# EAGLE design bipop_power_supply (EAGLE 8.3.2)
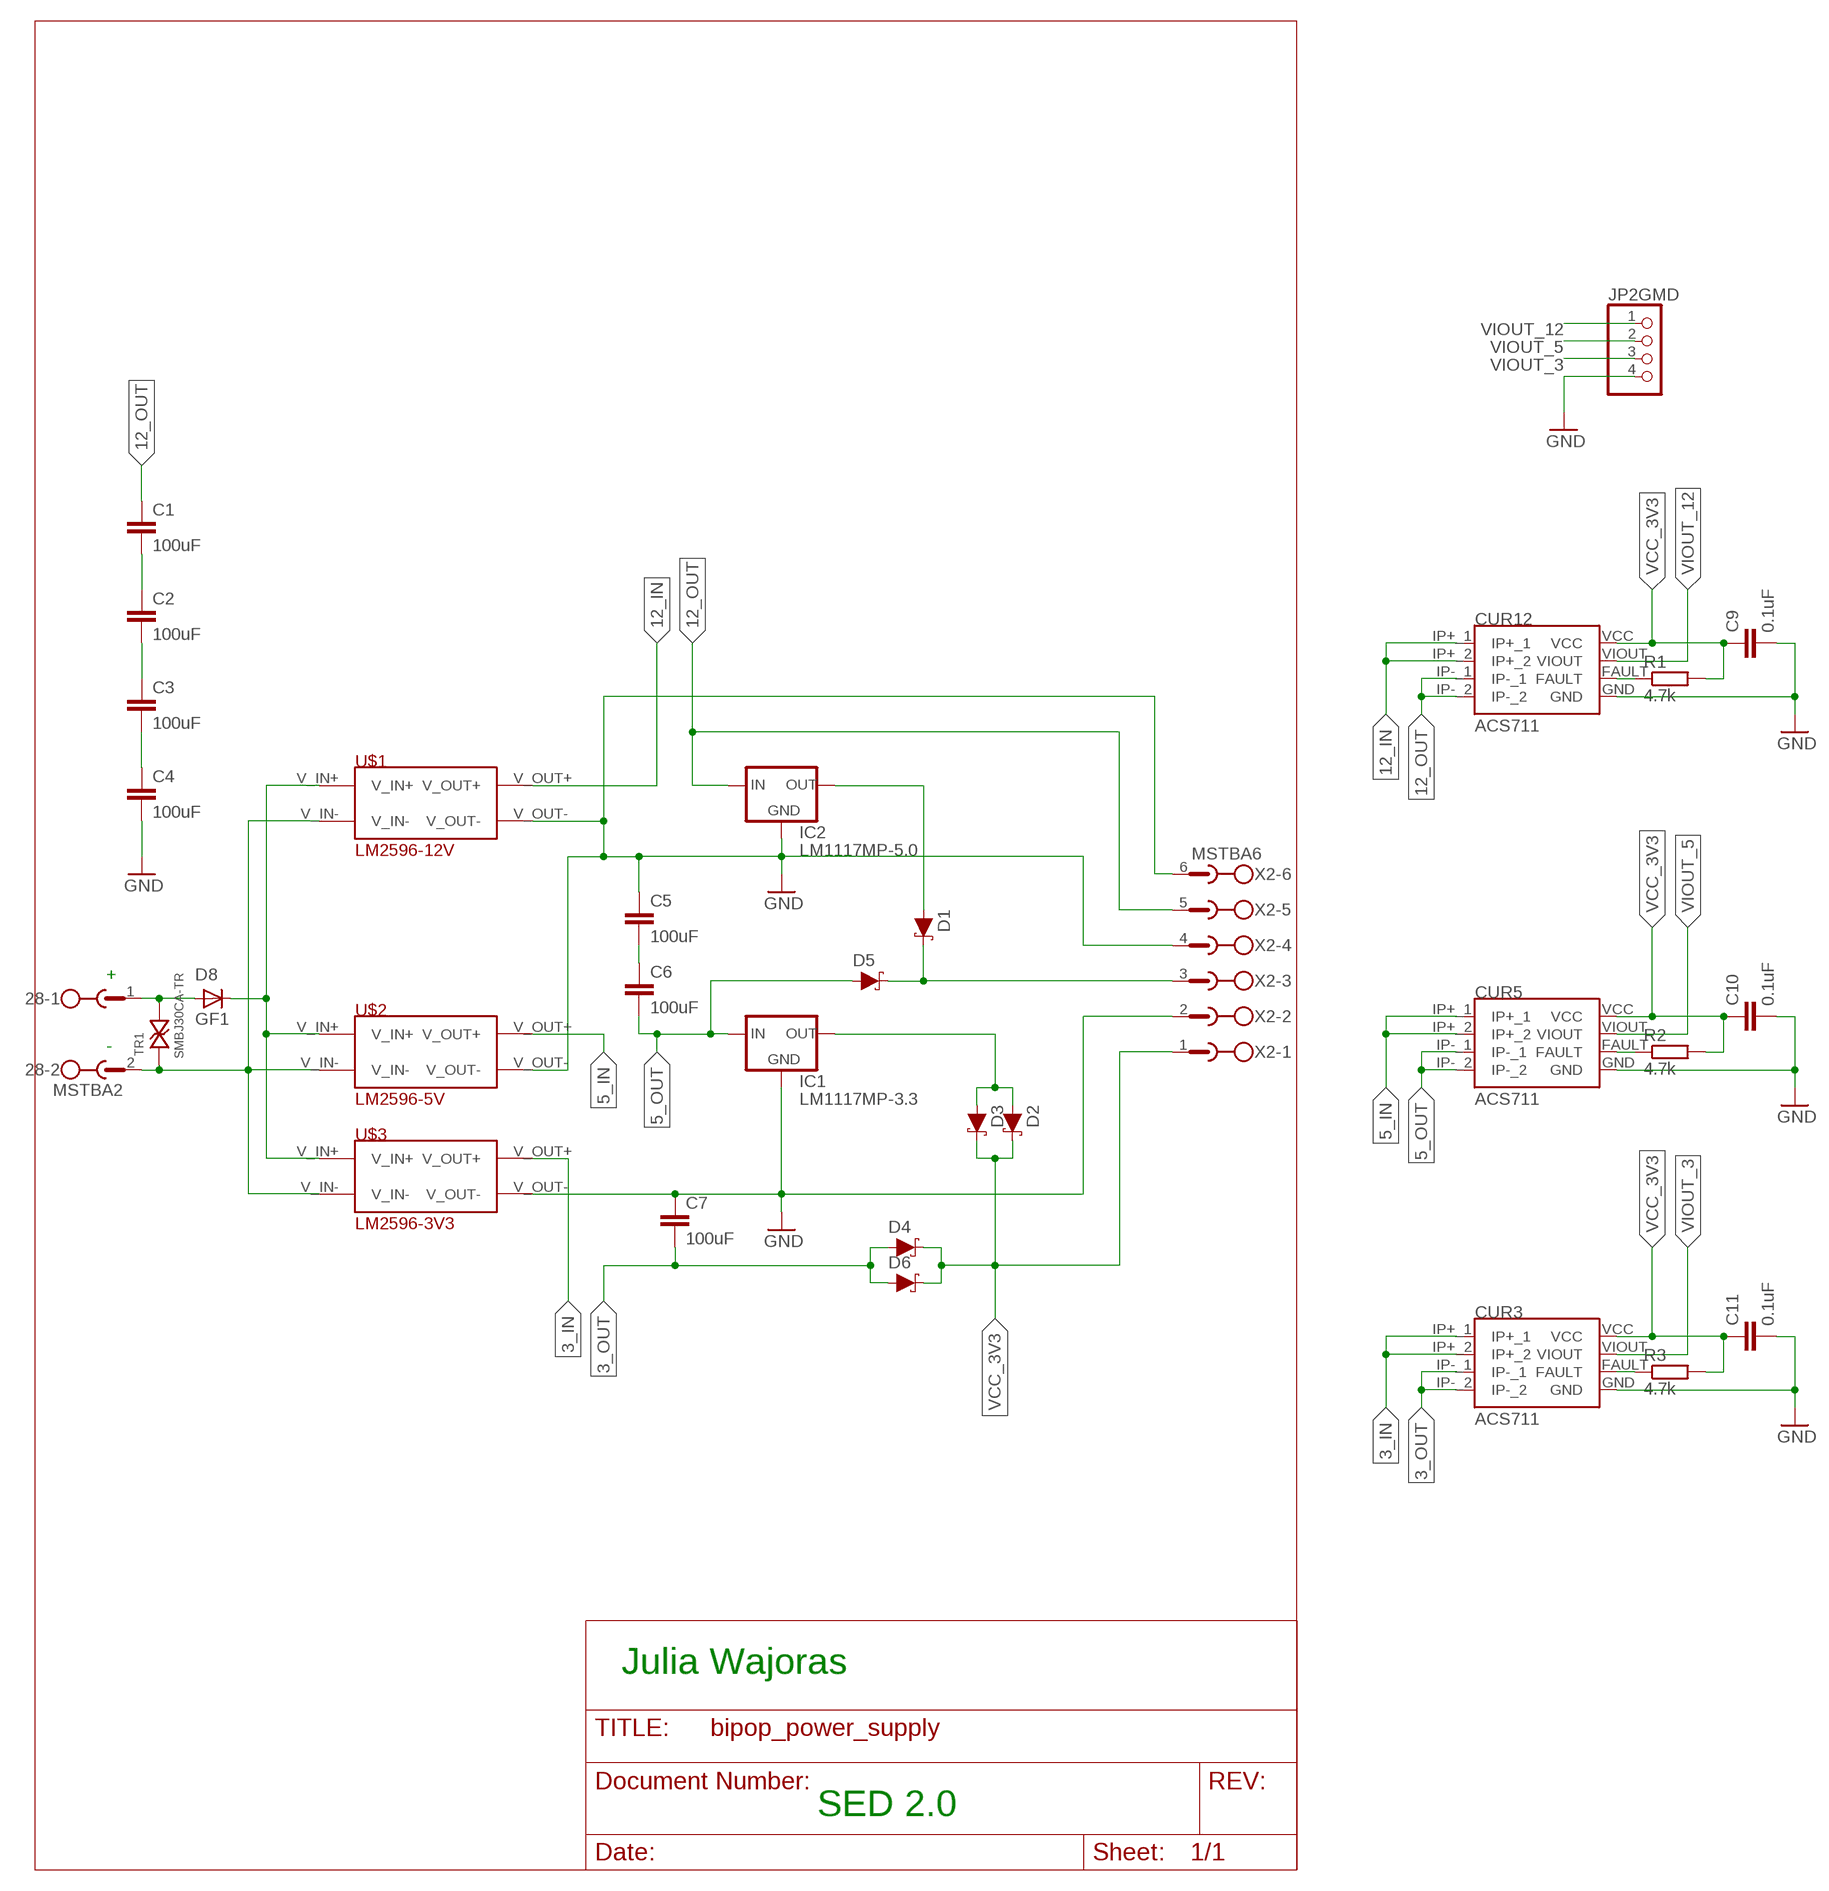
[diagram p0: schematic, sheet 1]

## Parts
28  MSTBA2  [MSTBA2]
C1  100uF  C-EUC0805  [C0805]
C2  100uF  C-EUC0805  [C0805]
C3  100uF  C-EUC0805  [C0805]
C4  100uF  C-EUC0805  [C0805]
C5  100uF  C-EUC0805  [C0805]
C6  100uF  C-EUC0805  [C0805]
C7  100uF  C-EUC0805  [C0805]
C9  0.1uF  C-EUC0805  [C0805]
C10  0.1uF  C-EUC0805  [C0805]
C11  0.1uF  C-EUC0805  [C0805]
CUR3  ACS711  [ACS711]
CUR5  ACS711  [ACS711]
CUR12  ACS711  [ACS711]
D1  DIODE-SCHOTTKY-BAT20J  [SOD-323]
D2  DIODE-SCHOTTKY-BAT20J  [SOD-323]
D3  DIODE-SCHOTTKY-BAT20J  [SOD-323]
D4  DIODE-SCHOTTKY-BAT20J  [SOD-323]
D5  DIODE-SCHOTTKY-BAT20J  [SOD-323]
D6  DIODE-SCHOTTKY-BAT20J  [SOD-323]
D8  GF1  [SMA-DO214AC]
IC1  LM1117MP-3.3  [SOT223]
IC2  LM1117MP-5.0  [SOT223]
JP2GMD  PINHD-1X4  [1X04]
R1  4.7k  R-EU_R0805  [R0805]
R2  4.7k  R-EU_R0805  [R0805]
R3  4.7k  R-EU_R0805  [R0805]
TR1  SMBJ30CA-TR  SMAJ30CA-TR__DO214AC  [DO214AC_BIDIR]
U$1  LM2596-12V  [DC-DC_CONVERTER]
U$2  LM2596-5V  [DC-DC_CONVERTER]
U$3  LM2596-3V3  [DC-DC_CONVERTER]
X2  MSTBA6  [MSTBA6]

## Nets
3_IN: CUR3.IP+_1 CUR3.IP+_2 U$3.V_OUT+
3_OUT: C7.2 CUR3.IP-_1 CUR3.IP-_2 D4.A D6.A
5_IN: CUR5.IP+_1 CUR5.IP+_2 U$2.V_OUT+
5_OUT: C6.2 CUR5.IP-_1 CUR5.IP-_2 D5.A IC1.3(IN)
12_IN: CUR12.IP+_1 CUR12.IP+_2 U$1.V_OUT+
12_OUT: C1.1 CUR12.IP-_1 CUR12.IP-_2 IC2.3(IN) X2.5
GND: C4.2 C5.1 C7.1 C9.2 C10.2 C11.2 CUR3.GND CUR5.GND CUR12.GND IC1.1(GND) IC2.1(GND) JP2GMD.4 U$1.V_OUT- U$2.V_OUT- U$3.V_OUT- X2.2 X2.4 X2.6
MM: D8.K(C) U$1.V_IN+ U$2.V_IN+ U$3.V_IN+
N$1: CUR3.FAULT R3.1
N$2: C2.2 C3.1
N$3: D1.A IC2.2(OUT)
N$4: CUR5.FAULT R2.1
N$5: D2.A D3.A IC1.2(OUT)
N$6: C3.2 C4.1
N$7: CUR12.FAULT R1.1
N$8: C5.2 C6.1
N$9: C1.2 C2.1
N$10: 28.2 TR1.P$1 U$1.V_IN- U$2.V_IN- U$3.V_IN-
N$12: 28.1 D8.A TR1.P$2
N$16: D1.C D5.C X2.3
VCC_3V3: C9.1 C10.1 C11.1 CUR3.VCC CUR5.VCC CUR12.VCC D2.C D3.C D4.C D6.C R1.2 R2.2 R3.2 X2.1
VIOUT_3: CUR3.VIOUT JP2GMD.3
VIOUT_5: CUR5.VIOUT JP2GMD.2
VIOUT_12: CUR12.VIOUT JP2GMD.1

## Notes on the sheet
- +
- -
- Julia Wajoras
- SED 2.0

## Library data of the parts
28 = con-phoenix-508:MSTBA2: PHOENIX
C1-C7 C9-C11 = rcl:C-EU: CAPACITOR, European symbol
CUR3 CUR5 CUR12 = lustro_pcb:ACS711
D1-D6 = sparkfun-discrete-semi:DIODE-SCHOTTKY: Schottky diode A Schottky diode is a semiconductor diode which has a low forward voltage drop and a very fast switching action.; PROD_ID: DIO-11623; VALUE: 1A/23V/620mV
D8 = _mod_diode:GF1: DIODE
IC1 = lm1117_10:LM1117?-*: 800mA Low-Dropout Linear Regulator Source: http://www.ti.com/lit/ds/symlink/lm1117-n.pdf; MF: Texas Instruments; MPN: LM1117MP-3.3; OC_FARNELL: 9778195; OC_NEWARK: 28X3416
IC2 = lm1117_10:LM1117?-*: 800mA Low-Dropout Linear Regulator Source: http://www.ti.com/lit/ds/symlink/lm1117-n.pdf; MF: Texas Instruments; MPN: LM1117MP-5.0; OC_FARNELL: 9778209; OC_NEWARK: 28X3417
JP2GMD = pinhead:PINHD-1X4: PIN HEADER
R1-R3 = rcl:R-EU_: RESISTOR, European symbol
TR1 = transil:SMAJ30CA-TR__DO214AC: Transil SMAJ 30 Volt BIDIR. DO214AC Package.
U$1-U$3 = lustro_pcb:LM2596-
X2 = con-phoenix-508:MSTBA6: PHOENIX; MF: FARNELL; MPN: 1757284; OC_FARNELL: 3705213; OC_NEWARK: 71C4165

## Net classes
0 default: width 0.508 mm

## Board
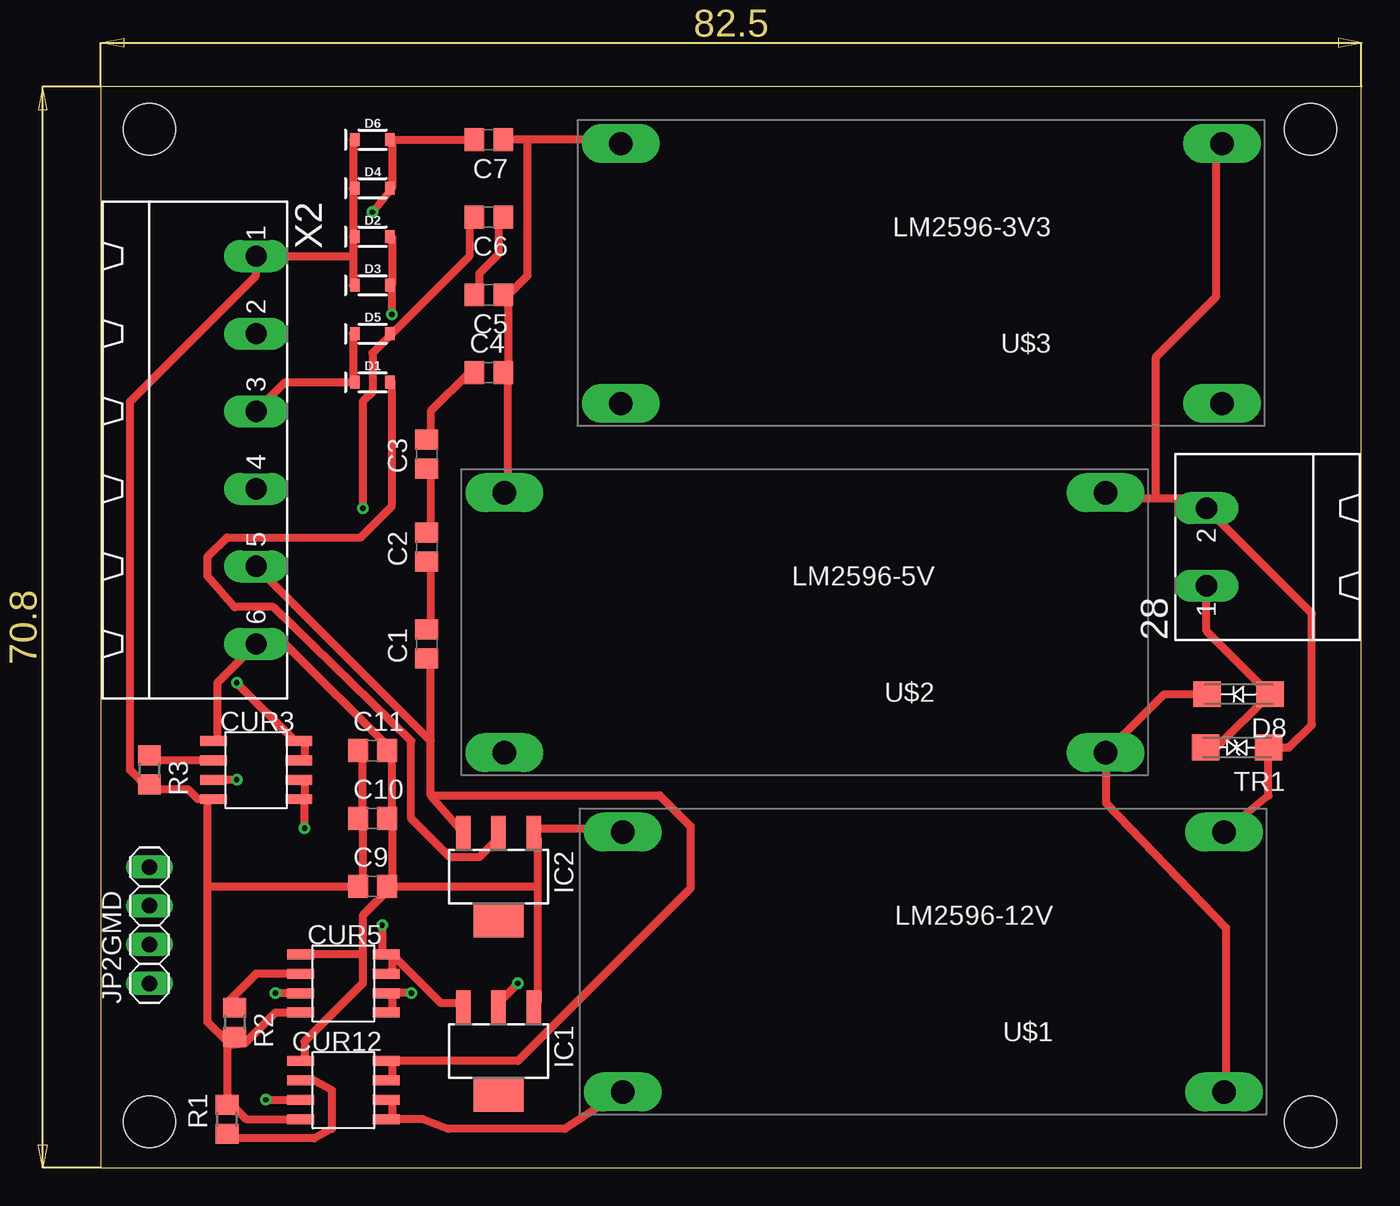
[diagram p1: board, top side]
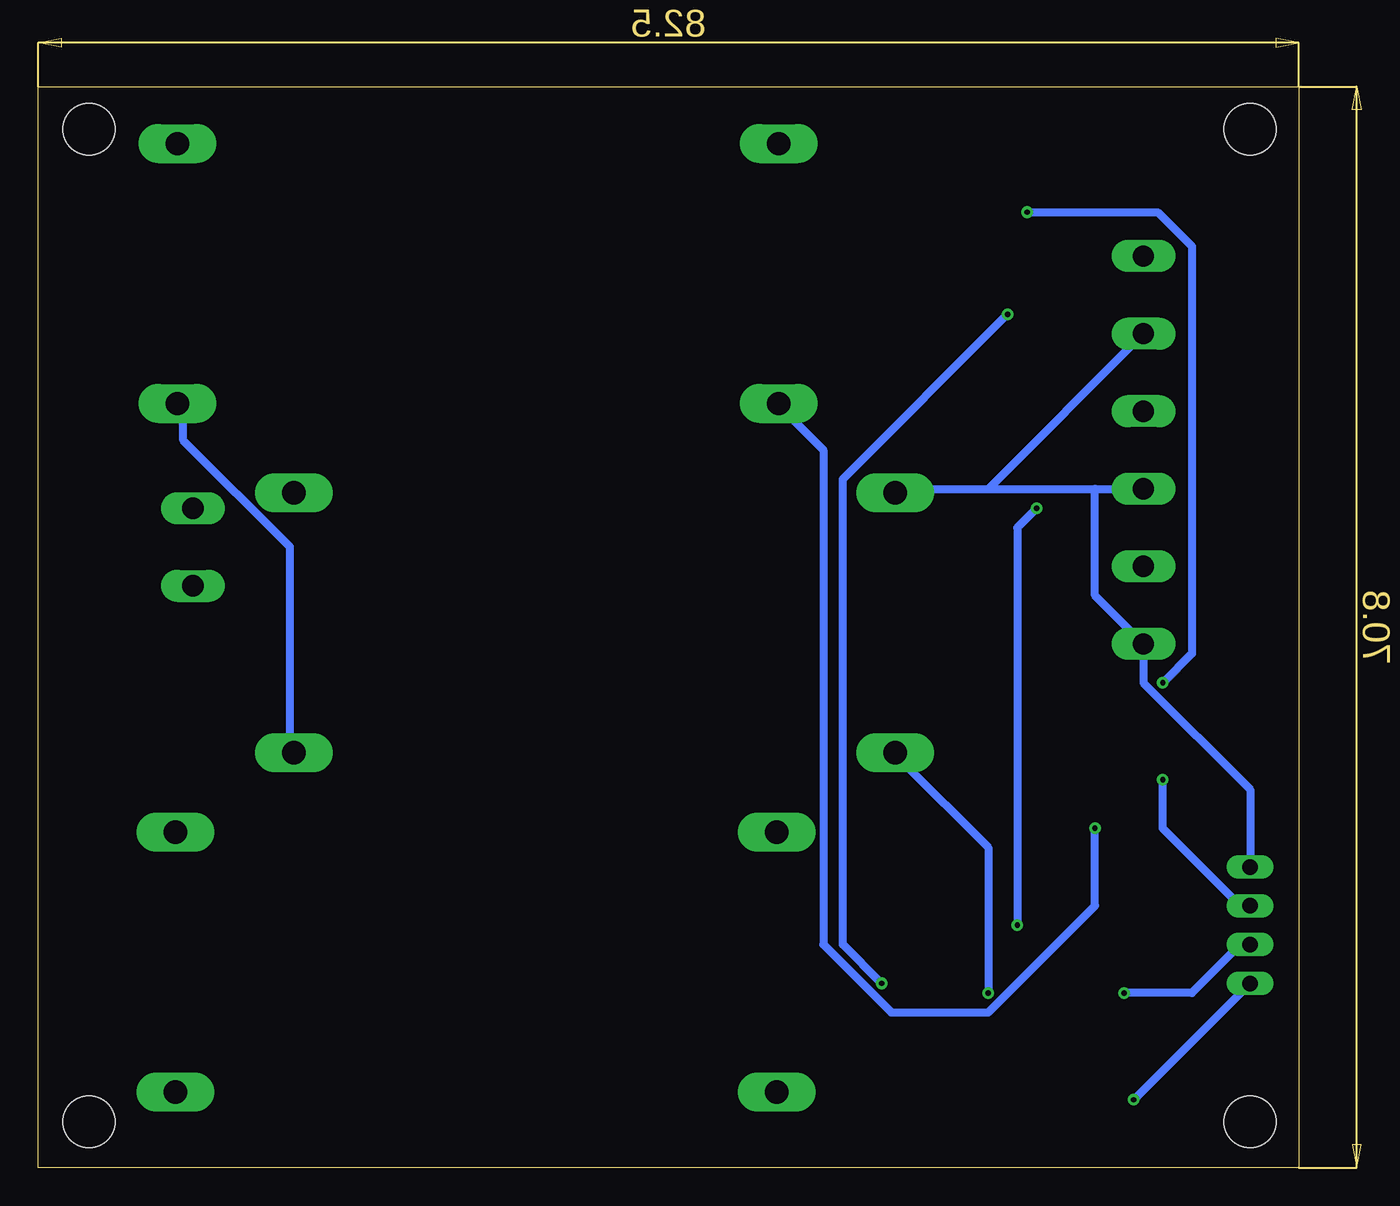
[diagram p2: board, bottom side, seen from below]

Size 82.53 x 70.79 mm. Coordinates in mm from the lower left corner, seen from the top.
Outline: 0,0 82.53,0 82.53,70.79 0,70.79 0,0
Copper layers (1*16): Top 0.035mm / dielectric 1.5mm / Bottom 0.035mm
Design rules "default *": minimum track width 8mil, minimum drill 0.35mm, track to track 10mil, track to pad 10mil, pad to pad 10mil, via to via 10mil, smd to smd 10mil, copper to edge 10mil, drill to drill 10mil, minimum pad ring 10mil, minimum via ring 8mil, stop-mask expansion 4mil, vias tented up to drill 0mil, thermal gap 10mil
Holes 3.4 mm at 3.19,68 3.19,3 79.19,68 79.19,3

### Footprints (pad centres in the part's own frame; a part is rotated, then mirrored left to right if it is on the bottom)
MSTBA2 = drill 1.397 long: 1 -2.54,5.08; 2 2.54,5.08
C0805 = smd 1.3 x 1.5: 1 -0.95,0; 2 0.95,0
ACS711 = smd 1.75 x 0.65: FAULT 2.8,-0.63; GND 2.8,-1.9; IP+_1 -2.8,1.91; IP+_2 -2.8,0.64; IP-_1 -2.8,-0.63; IP-_2 -2.8,-1.9; VCC 2.8,1.91; VIOUT 2.8,0.64
SOD-323 = smd 0.63 x 0.83: A 1.15,0; C -1.15,0
SMA-DO214AC = smd 1.8 x 1.7: A -2.05,0; K 2.05,0
SOT223 = smd 0.95 x 2.15: 1 -2.3,-2.9; 2 0,-2.9; 3 2.3,-2.9 | smd 3.25 x 2.15: 4 0,2.9
1X04 = drill 1.016 long: 1 -3.81,0; 2 -1.27,0; 3 1.27,0; 4 3.81,0
R0805 = smd 1.3 x 1.5: 1 -0.95,0; 2 0.95,0
DO214AC_BIDIR = smd 1.8 x 1.7: P$1 -2.05,0; P$2 2.05,0
DC-DC_CONVERTER = drill 1.524 pad 2.54 long: V_IN+ -18.796,8.382; V_IN- -18.796,-8.636; V_OUT+ 20.574,8.382; V_OUT- 20.574,-8.636
MSTBA6 = drill 1.397 long: 1 -12.7,5.08; 2 -7.62,5.08; 3 -2.54,5.08; 4 2.54,5.08; 5 7.62,5.08; 6 12.7,5.08

### Placement (x,y rotation side)
28  77.47,40.64 90 top
C1  21.34,34.29 90 top
C2  21.34,40.64 90 top
C3  21.34,46.74 90 top
C4  25.4,52.07 0 top
C5  25.4,57.15 180 top
C6  25.4,62.23 180 top
C7  25.4,67.31 180 top
C9  17.78,18.41 0 top
C10  17.78,22.86 0 top
C11  17.78,27.3 0 top
CUR3  10.16,26.04 180 top
CUR5  15.87,12.06 180 top
CUR12  15.87,5.08 180 top
D1  17.78,51.44 0 top
D2  17.78,60.96 0 top
D3  17.78,57.78 0 top
D4  17.78,64.14 0 top
D5  17.78,54.61 0 top
D6  17.78,67.31 0 top
D8  74.49,31 180 top
IC1  26.04,7.62 180 top
IC2  26.04,19.05 180 top
JP2GMD  3.18,15.88 90 top
R1  8.25,3.17 90 top
R2  8.76,9.53 270 top
R3  3.18,26.04 270 top
TR1  74.39,27.5 180 top
U$1  54.74,13.34 180 top
U$2  46.99,35.56 180 top
U$3  54.61,58.42 180 top
U$4  [A5P-LOC]  -35.56,-48.26 0 top  (outside the outline)
X2  5.08,46.99 270 top

### Tracks (layer width: path | path; a pad name or v marks a point on that pad's centre or on a via)
3_IN  (via drill 0.35)
  Top 0.508: 13.33,24.13 13.33,25.4 CUR3.IP+_2 | v13.33,22.23 13.33,24.13 | 13.33,24.13 CUR3.IP+_1
  Bottom 0.508: v13.33,22.23 13.33,17.14 20.32,10.16 26.67,10.16 31.11,14.61 31.11,46.99 33.66,49.53 U$3.V_OUT+
3_OUT  (via drill 0.35)
  Top 0.508: CUR3.IP-_1 13.33,26.67 13.33,27.94 CUR3.IP-_2 12.7,27.94 v8.89,31.75 | 19.05,67.31 19.05,64.14 | 19.05,67.31 C7.2 | 19.05,67.31 D6.A | 19.05,64.14 v17.78,62.56 | 19.05,64.14 D4.A
  Bottom 0.508: v8.89,31.75 6.98,33.66 6.98,60.33 9.22,62.56 v17.78,62.56
5_IN  (via drill 0.35)
  Top 0.508: 19.05,11.43 19.05,10.16 CUR5.IP+_1 | v20.32,11.43 19.05,11.43 | 19.05,11.43 CUR5.IP+_2
  Bottom 0.508: v20.32,11.43 20.32,20.95 26.04,26.67 U$2.V_OUT+
5_OUT  (via drill 0.35)
  Top 0.508: 19.05,13.97 19.05,12.7 CUR5.IP-_1 | 19.05,13.97 22.23,10.79 23.5,10.79 IC1.3 | 19.05,13.97 CUR5.IP-_2 18.42,13.97 v18.42,15.88 | 19.05,54.61 24.13,59.69 24.13,62.23 C6.2 | v17.14,43.18 17.14,50.16 17.78,50.8 17.78,53.34 19.05,54.61 | 19.05,54.61 D5.A
  Bottom 0.508: v18.42,15.88 18.42,41.91 v17.14,43.18
12_IN
  Top 0.508: 19.05,3.17 19.05,4.45 CUR12.IP+_2 | 19.05,3.17 21.08,3.17 22.73,2.54 30.39,2.54 33.29,4.45 U$1.V_OUT+ | 19.05,3.17 CUR12.IP+_1
12_OUT
  Top 0.508: 19.05,6.99 19.05,5.71 CUR12.IP-_1 | 21.59,24.38 21.59,27.94 | 21.59,27.94 21.59,33.02 C1.1 | 21.59,24.38 23.5,22.23 IC2.3 | 19.05,6.99 27.3,6.99 38.61,18.29 38.61,22.35 36.58,24.38 21.59,24.38 | 19.05,6.99 CUR12.IP-_2 | 21.59,27.94 X2.5
GND
  Top 0.508: 27.94,67.31 33.66,67.31 U$3.V_OUT- | 27.94,67.31 C7.1 | 26.67,57.15 26.67,52.07 | 26.67,52.07 26.67,44.45 U$2.V_OUT- | 26.67,52.07 C4.2 | 27.94,67.31 27.94,58.42 26.67,57.15 | 26.67,57.15 C5.1 | CUR3.GND 7.62,27.94 7.62,31.75 X2.6 12.06,34.29 19.05,27.3 | 28.57,18.41 28.57,21.59 IC2.1 28.57,22.23 34.29,22.23 U$1.V_OUT- | 28.57,18.41 28.57,10.79 IC1.1 | 19.05,22.86 19.05,18.41 | 19.05,22.86 19.05,27.3 | 19.05,22.86 C10.2 | 17.14,13.97 17.14,16.51 19.05,18.41 | 17.14,13.97 17.14,12.06 13.33,8.26 13.33,6.99 CUR12.GND | 17.14,13.97 13.33,13.97 CUR5.GND | 19.05,18.41 28.57,18.41 | 19.05,18.41 C9.2 | 19.05,27.3 C11.2
  Bottom 0.508: 20.32,44.45 26.04,44.45 U$2.V_OUT- | 20.32,44.45 13.33,44.45 | 13.33,44.45 X2.4 | 20.32,44.45 X2.2 | JP2GMD.4 3.18,24.77 10.16,31.75 X2.6 13.33,37.47 13.33,44.45
MM
  Top 0.508: U$1.V_IN+ 73.66,5.08 73.66,15.71 65.8,23.87 U$2.V_IN+ 69.61,31 D8.K
  Bottom 0.508: U$3.V_IN+ 73.02,49.53 73.02,47.62 66.04,40.64 66.04,27.3 U$2.V_IN+
N$1
  Top 0.508: R3.1 3.18,26.67 6.98,26.67 CUR3.FAULT
N$2
  Top 0.508: C2.2 21.59,41.91 21.59,45.72 C3.1
N$3
  Top 0.508: D1.A 19.05,51.44 19.05,43.31 17.02,41.27 8.25,41.27 6.98,40.01 6.98,38.73 8.76,36.7 11.3,36.7 20.32,27.94 20.32,22.86 22.86,20.32 24.77,20.32 26.04,21.59 IC2.2
N$4
  Top 0.508: R2.1 8.25,10.79 10.16,12.7 12.7,12.7 CUR5.FAULT
N$5  (via drill 0.35)
  Top 0.508: 19.05,57.78 19.05,60.96 D2.A | v19.05,55.88 19.05,57.78 | v27.3,12.06 26.04,10.79 IC1.2 | 19.05,57.78 D3.A
  Bottom 0.508: v19.05,55.88 29.85,45.09 29.85,14.61 v27.3,12.06
N$6
  Top 0.508: C3.2 21.59,48.26 21.59,49.53 24.13,52.07 C4.1
N$7
  Top 0.508: R1.1 8.25,1.91 13.97,1.91 15.11,2.54 15.11,5.08 13.97,5.71 13.33,5.71 CUR12.FAULT
N$8
  Top 0.508: C5.2 24.77,57.15 24.77,58.55 26.04,59.82 26.04,62.23 C6.1
N$9
  Top 0.508: C1.2 21.59,35.56 21.59,39.37 C2.1
N$10
  Top 0.508: 69.09,43.81 71.75,43.81 28.2 79.29,36.28 79.29,29 77.79,27.5 TR1.P$1 76.44,24.37 U$1.V_IN- | 69.09,43.81 66.04,43.81 U$2.V_IN- | 69.09,43.81 69.09,53.09 73.02,57.02 73.02,66.67 U$3.V_IN-
N$12
  Top 0.508: TR1.P$2 73.04,27.5 D8.A 72.39,35.15 28.1
N$16
  Top 0.508: 16.51,51.44 16.51,54.61 D5.C | 16.51,51.44 12.06,51.44 X2.3 | 16.51,51.44 D1.C
VCC_3V3
  Top 0.508: 16.51,60.96 16.51,59.69 | 16.51,59.69 16.51,57.78 D3.C | 16.51,64.14 16.51,67.31 D6.C | 16.51,64.14 16.51,60.96 | 16.51,60.96 D2.C | 16.51,64.14 D4.C | 16.51,59.69 X2.1 10.16,58.42 1.9,50.16 1.9,26.04 3.18,24.77 | 17.14,22.86 17.14,18.41 C9.1 6.98,18.41 | 17.14,22.86 17.14,27.3 C11.1 | 17.14,22.86 C10.1 | 3.18,24.77 5.71,24.77 6.35,24.13 6.98,24.13 | 8.25,8.26 8.25,8 | 8.25,8 8.25,4.45 | 8.25,4.45 9.53,3.17 12.7,3.17 CUR12.VCC | 8.25,4.45 R1.2 | 8.25,8 9.4,8.13 11.43,10.16 12.7,10.16 CUR5.VCC | 6.98,18.41 6.98,9.53 8.25,8.26 | 6.98,18.41 6.98,24.13 | 6.98,24.13 CUR3.VCC | 8.25,8.26 R2.2 | 3.18,24.77 R3.2
VIOUT_3  (via drill 0.35)
  Top 0.508: v8.89,25.4 7.62,25.4 CUR3.VIOUT
  Bottom 0.508: v8.89,25.4 8.89,22.23 3.81,17.14 JP2GMD.3
VIOUT_5  (via drill 0.35)
  Top 0.508: v11.43,11.43 12.7,11.43 CUR5.VIOUT
  Bottom 0.508: v11.43,11.43 6.98,11.43 3.81,14.61 JP2GMD.2
VIOUT_12  (via drill 0.35)
  Top 0.508: v10.79,4.45 12.7,4.45 CUR12.VIOUT
  Bottom 0.508: JP2GMD.1 v10.79,4.45

### Text on the board
Top: Julia Wajoras | SED 2.0